# EAGLE design rpiSensors (EAGLE 6.2)
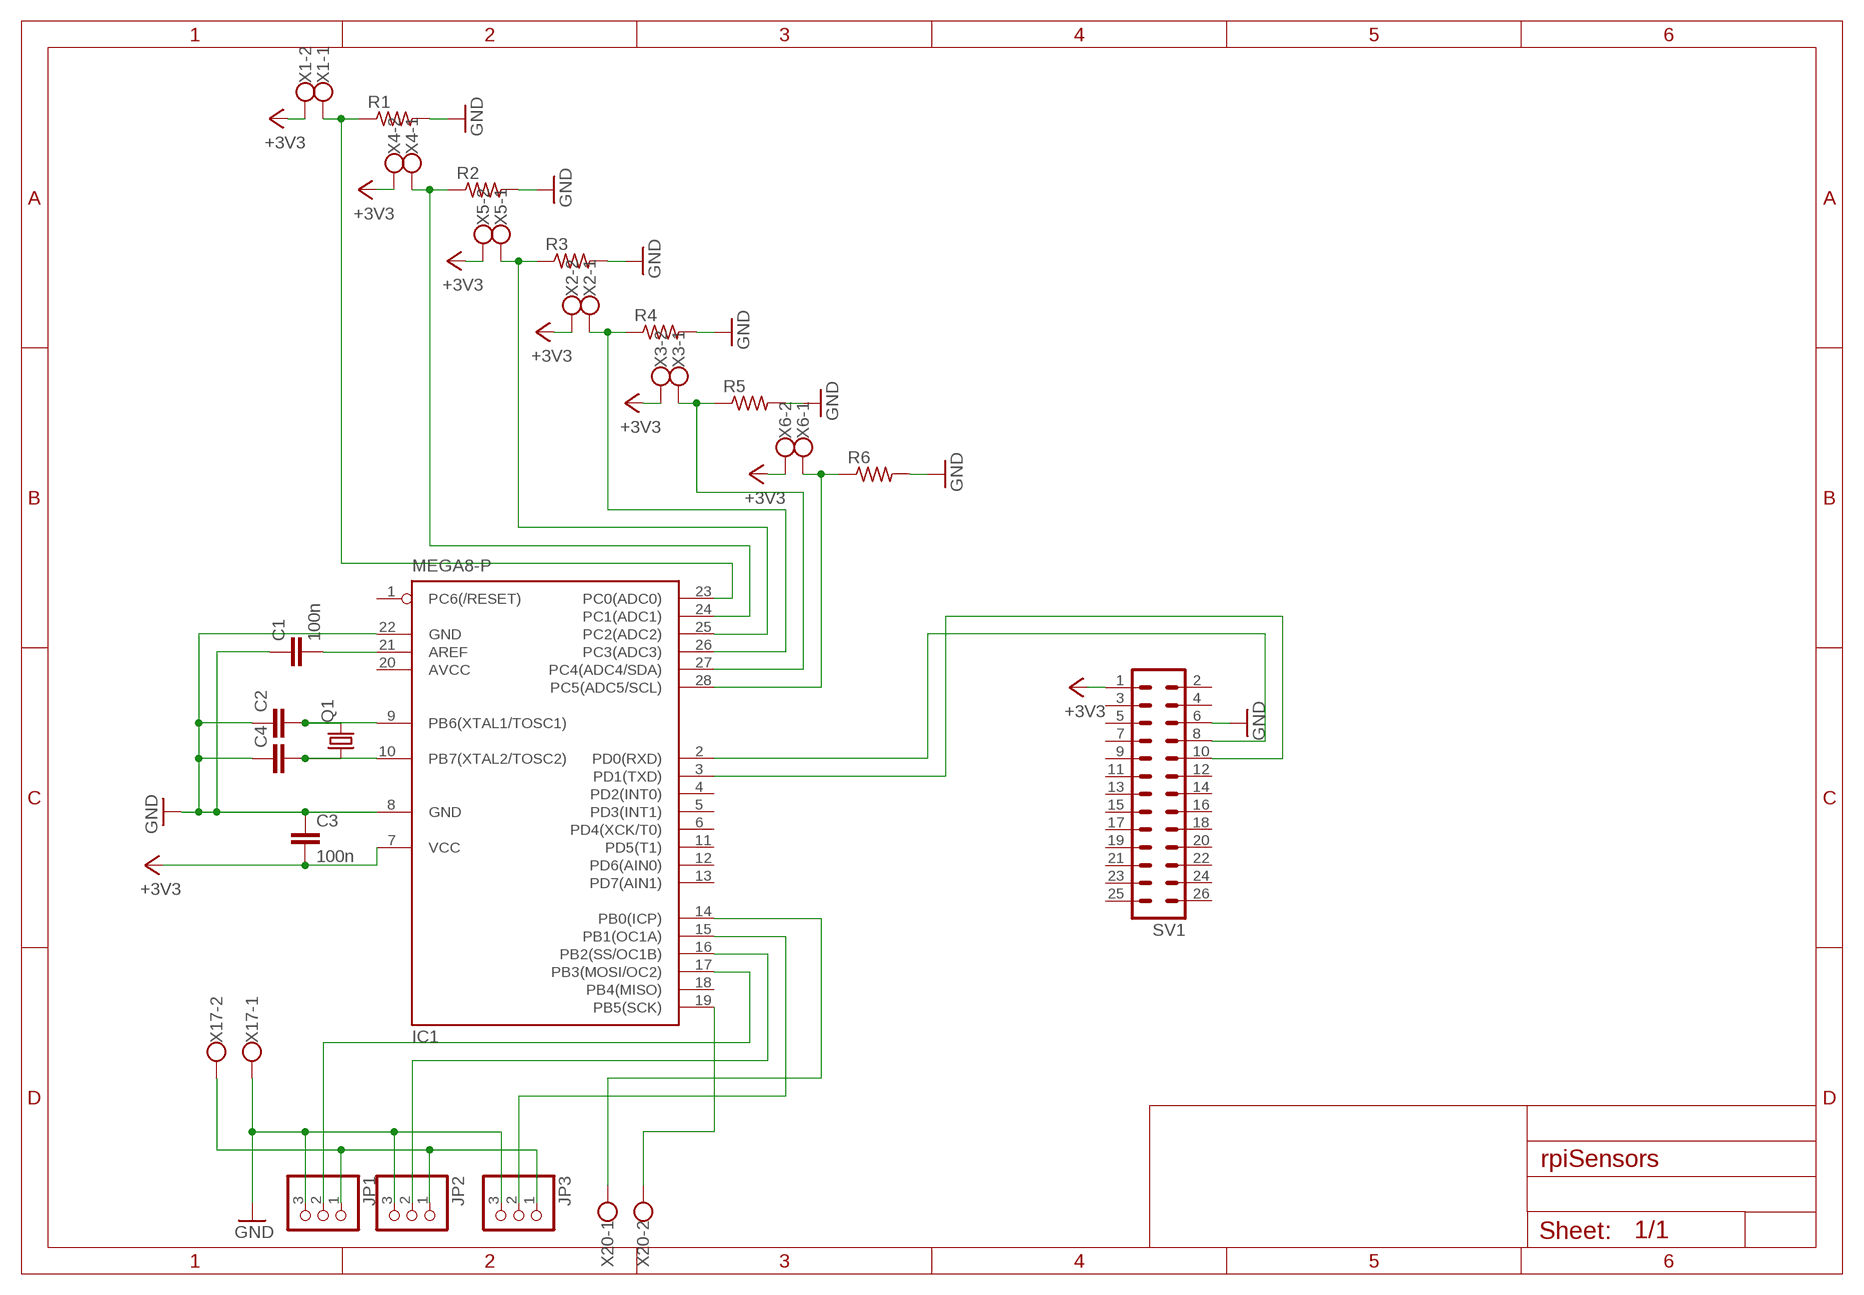
[diagram p0: schematic, sheet 1]

## Parts
C1  100n  C2,5-3  [C2.5-3]
C2  C5/2.5  [C5B2.5]
C3  100n  C2,5-3  [C2.5-3]
C4  C5/2.5  [C5B2.5]
IC1  MEGA8-P  [DIL28-3]
JP1  PINHD-1X3  [1X03]
JP2  PINHD-1X3  [1X03]
JP3  PINHD-1X3  [1X03]
Q1  CRYSTALHC49S  [HC49/S]
R1  R-US_0309/12  [0309/12]
R2  R-US_0309/12  [0309/12]
R3  R-US_0309/12  [0309/12]
R4  R-US_0309/12  [0309/12]
R5  R-US_0309/12  [0309/12]
R6  R-US_0309/12  [0309/12]
SV1  ML26  [ML26]
X1  W237-102  [W237-102]
X2  W237-102  [W237-102]
X3  W237-102  [W237-102]
X4  W237-102  [W237-102]
X5  W237-102  [W237-102]
X6  W237-102  [W237-102]
X17  W237-102  [W237-102]
X20  W237-102  [W237-102]

## Nets
+3V3: C3.2 IC1.7(VCC) SV1.1 X1.2 X2.2 X3.2 X4.2 X5.2 X6.2
GND: C1.1 C2.1 C3.1 C4.1 IC1.8(GND) IC1.22(GND) JP1.3 JP2.3 JP3.3 R1.2 R2.2 R3.2 R4.2 R5.2 R6.2 SV1.6 X17.1
N$1: IC1.2(PD0(RXD)) SV1.8
N$2: IC1.3(PD1(TXD)) SV1.10
N$3: IC1.23(PC0(ADC0)) R1.1 X1.1
N$4: IC1.24(PC1(ADC1)) R2.1 X4.1
N$5: IC1.27(PC4(ADC4/SDA)) R5.1 X3.1
N$6: IC1.25(PC2(ADC2)) R3.1 X5.1
N$7: IC1.26(PC3(ADC3)) R4.1 X2.1
N$8: IC1.28(PC5(ADC5/SCL)) R6.1 X6.1
N$23: IC1.17(PB3(MOSI/OC2)) JP1.2
N$24: IC1.16(PB2(SS/OC1B)) JP2.2
N$25: IC1.15(PB1(OC1A)) JP3.2
N$27: IC1.19(PB5(SCK)) X20.2
N$28: IC1.14(PB0(ICP)) X20.1
N$35: C1.2 IC1.21(AREF)
N$36: JP1.1 JP2.1 JP3.1 X17.2
N$37: C2.2 IC1.9(PB6(XTAL1/TOSC1)) Q1.2
N$38: C4.2 IC1.10(PB7(XTAL2/TOSC2)) Q1.1
Unconnected: IC1.1(PC6(/RESET)) IC1.4(PD2(INT0)) IC1.5(PD3(INT1)) IC1.6(PD4(XCK/T0)) IC1.11(PD5(T1)) IC1.12(PD6(AIN0)) IC1.13(PD7(AIN1)) IC1.18(PB4(MISO)) SV1.2 SV1.3 SV1.4 SV1.5 SV1.7 SV1.9 SV1.11 SV1.12 SV1.13 SV1.14 SV1.15 SV1.16 SV1.17 SV1.18 SV1.19 SV1.20 SV1.21 SV1.22 SV1.23 SV1.24 SV1.25 SV1.26

## Power pins joined to a net without a drawn wire
AVCC: IC1.20(AVCC)

## Library data of the parts
C1-C4 = capacitor-wima:C: CAPACITOR naming: grid - package width
IC1 = atmel:MEGA8-P: MICROCONTROLLER 8 Kbytes FLASH, 1 kbytes SRAM, 512 bytes EEPROM, USART, 4-channel 10 bit ADC, 2-channel 8 bit ADC Pin compatible with Atmega48, ATMega88, ATMega168 Source: avr.lbr; OC_FARNELL: unknown; OC_NEWARK: unknown
JP1-JP3 = pinhead:PINHD-1X3: PIN HEADER
Q1 = crystal:CRYSTAL: CRYSTAL; OC_FARNELL: 1667008; OC_NEWARK: unknown
R1-R6 = resistor:R-US_: RESISTOR, American symbol
SV1 = con-harting-ml:ML26: HARTING; OC_FARNELL: unknown; OC_NEWARK: unknown
X1-X6 X17 X20 = con-wago-500:W237-102: WAGO SCREW CLAMP; MPN: 237-102; OC_FARNELL: unknown; OC_NEWARK: 70K9898

## Board
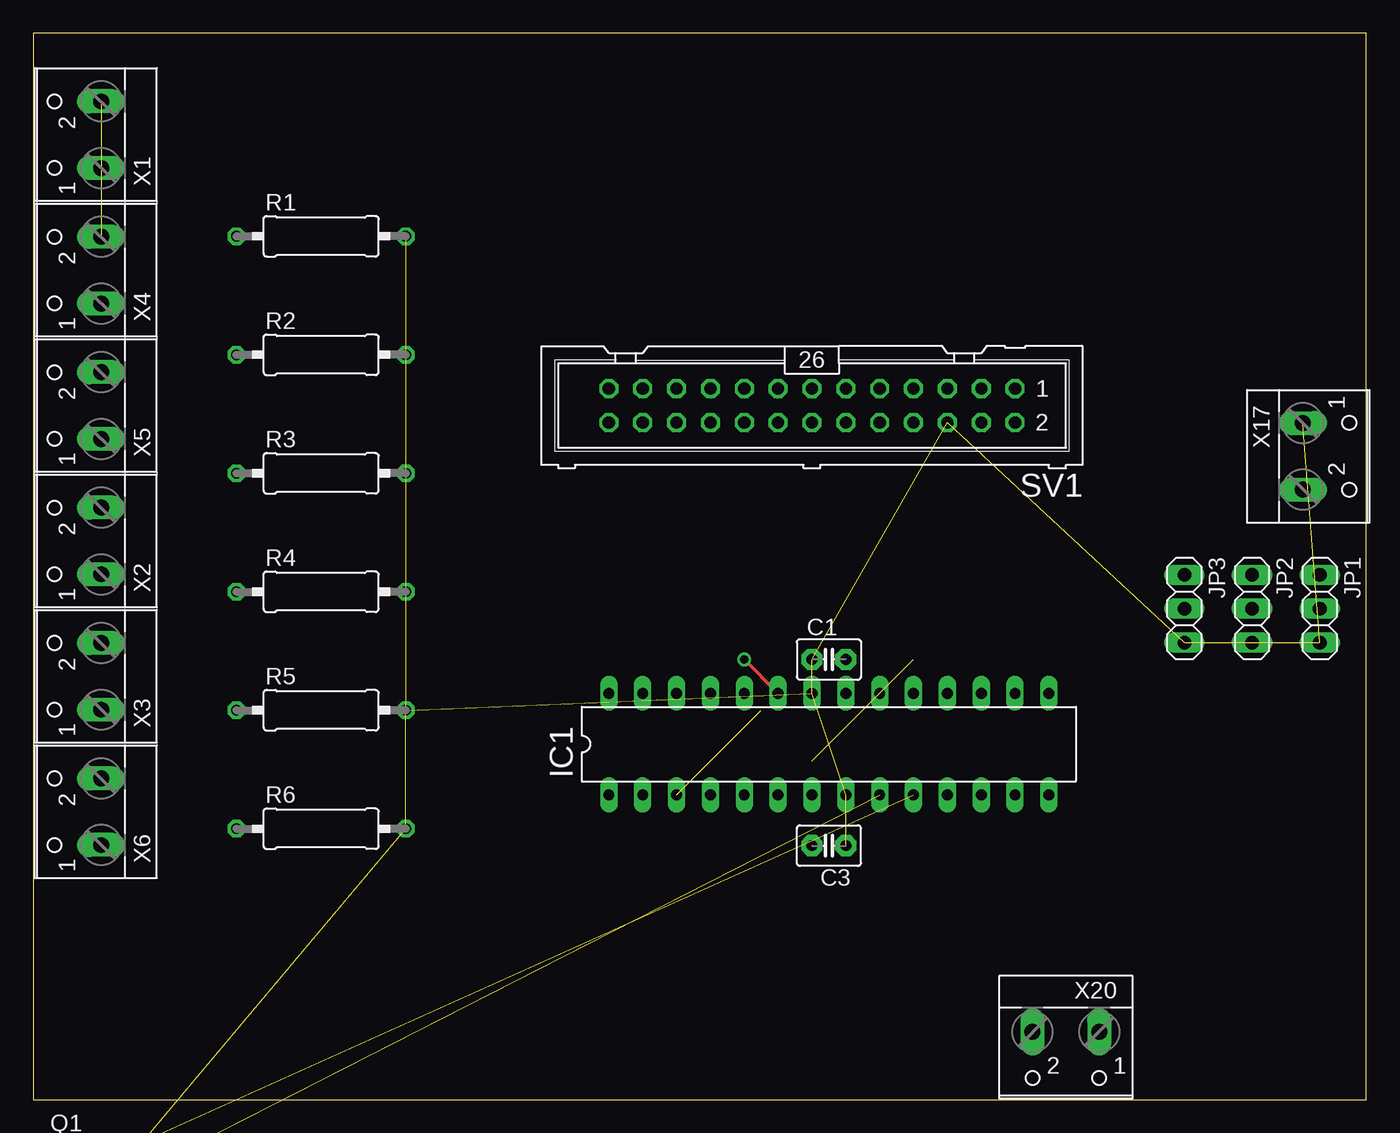
[diagram p1: board, top side]
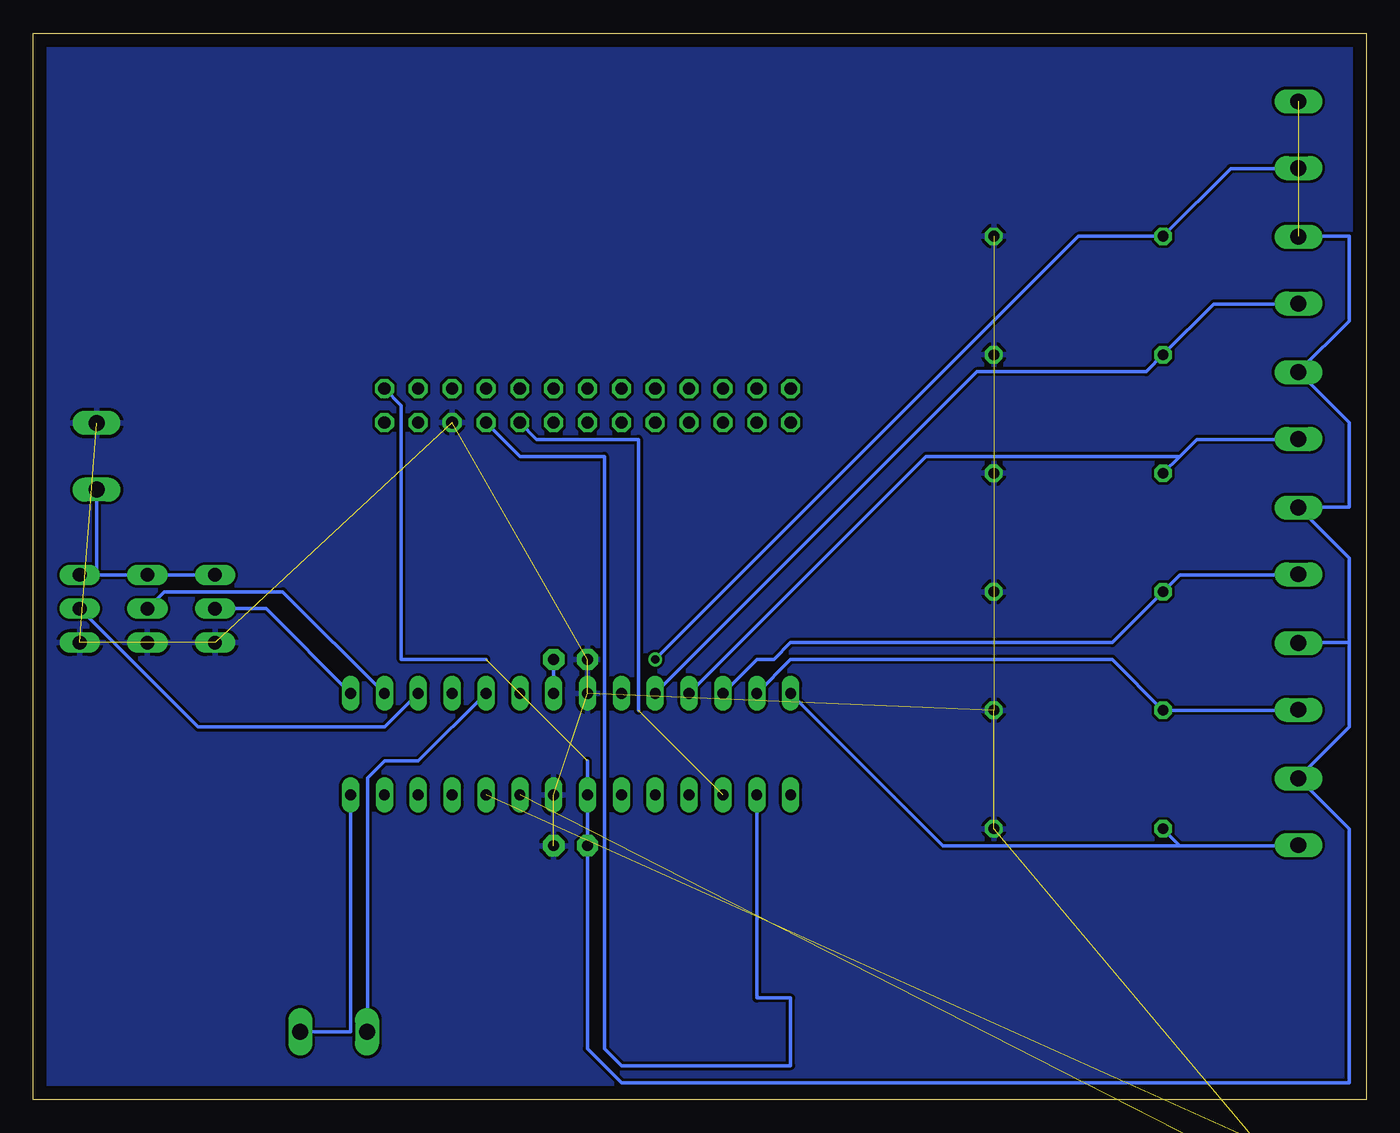
[diagram p2: board, bottom side, seen from below]

Size 100 x 80 mm. Coordinates in mm from the lower left corner, seen from the top.
Outline: 0,0 100,0 100,80 0,80 0,0
Copper layers (1*16): Top 0.035mm / dielectric 1.5mm / Bottom 0.035mm
Design rules: minimum track width 10mil, minimum drill 24mil, track to track 8mil, track to pad 8mil, pad to pad 8mil, via to via 8mil, smd to smd 8mil, copper to edge 40mil, drill to drill 8mil, minimum pad ring 10mil, minimum via ring 8mil, stop-mask expansion 4mil, vias tented up to drill 0mil, thermal gap 10mil

### Footprints (pad centres in the part's own frame; a part is rotated, then mirrored left to right if it is on the bottom)
C2.5-3 = drill 0.813 pad 1.6 octagon: 1 -1.27,0; 2 1.27,0
C5B2.5 = drill 0.813 pad 1.6 octagon: 1 -2.54,0; 2 2.54,0
DIL28-3 = drill 0.813 long: 1 -16.51,-3.81; 2 -13.97,-3.81; 3 -11.43,-3.81; 4 -8.89,-3.81; 5 -6.35,-3.81; 6 -3.81,-3.81; 7 -1.27,-3.81; 8 1.27,-3.81; 9 3.81,-3.81; 10 6.35,-3.81; 11 8.89,-3.81; 12 11.43,-3.81; 13 13.97,-3.81; 14 16.51,-3.81; 15 16.51,3.81; 16 13.97,3.81; 17 11.43,3.81; 18 8.89,3.81; 19 6.35,3.81; 20 3.81,3.81; 21 1.27,3.81; 22 -1.27,3.81; 23 -3.81,3.81; 24 -6.35,3.81; 25 -8.89,3.81; 26 -11.43,3.81; 27 -13.97,3.81; 28 -16.51,3.81
1X03 = drill 1.016 long: 1 -2.54,0; 2 0,0; 3 2.54,0
HC49/S = drill 0.813: 1 -2.413,0; 2 2.413,0
0309/12 = drill 0.813 octagon: 1 -6.35,0; 2 6.35,0
ML26 = drill 0.914 octagon: 1 -15.24,-1.27; 2 -15.24,1.27; 3 -12.7,-1.27; 4 -12.7,1.27; 5 -10.16,-1.27; 6 -10.16,1.27; 7 -7.62,-1.27; 8 -7.62,1.27; 9 -5.08,-1.27; 10 -5.08,1.27; 11 -2.54,-1.27; 12 -2.54,1.27; 13 0,-1.27; 14 0,1.27; 15 2.54,-1.27; 16 2.54,1.27; 17 5.08,-1.27; 18 5.08,1.27; 19 7.62,-1.27; 20 7.62,1.27; 21 10.16,-1.27; 22 10.16,1.27; 23 12.7,-1.27; 24 12.7,1.27; 25 15.24,-1.27; 26 15.24,1.27
W237-102 = drill 1.194 long: 1 -2.5,-1.27; 2 2.5,-1.27

### Placement (x,y rotation side)
C1  59.69,33.02 0 top
C2  3.81,-11.43 0 top  (outside the outline)
C3  59.69,19.05 180 top
C4  3.81,-16.51 0 top  (outside the outline)
IC1  59.69,26.67 0 top
JP1  96.52,36.83 270 top
JP2  91.44,36.83 270 top
JP3  86.36,36.83 270 top
Q1  6.35,-5.08 0 top  (outside the outline)
R1  21.59,64.77 0 top
R2  21.59,55.88 0 top
R3  21.59,46.99 0 top
R4  21.59,38.1 0 top
R5  21.59,29.21 0 top
R6  21.59,20.32 0 top
SV1  58.42,52.07 180 top
X1  3.81,72.39 90 top
X2  3.81,41.91 90 top
X3  3.81,31.75 90 top
X4  3.81,62.23 90 top
X5  3.81,52.07 90 top
X6  3.81,21.59 90 top
X17  96.52,48.26 270 top
X20  77.47,3.81 180 top

### Tracks (layer width: path | path; a pad name or v marks a point on that pad's centre or on a via)
+3V3  (2 unrouted)
  Bottom 0.254: 5.08,54.61 1.27,58.42 1.27,64.77 5.08,64.77 X4.2 | 5.08,24.13 1.27,27.94 1.27,34.29 | 1.27,34.29 5.08,34.29 X3.2 | 5.08,44.45 1.27,40.64 1.27,34.29 | 5.08,54.61 1.27,50.8 1.27,44.45 5.08,44.45 | 5.08,54.61 X5.2 | 5.08,44.45 X2.2 | 58.42,25.4 IC1.7 C3.2 58.42,3.81 55.88,1.27 1.27,1.27 1.27,20.32 5.08,24.13 | SV1.1 72.39,52.07 72.39,33.02 66.04,33.02 | 5.08,24.13 X6.2
GND  (16 unrouted)
  pour Bottom: 0,80.01 100.33,80.01 100.33,0 0,0
N$1
  Bottom 0.254: IC1.2 45.72,7.62 43.18,7.62 43.18,2.54 55.88,2.54 57.15,3.81 57.15,48.26 63.5,48.26 SV1.8
N$2  (1 unrouted)
  Bottom 0.254: 54.61,29.21 54.61,49.53 62.23,49.53 SV1.10
N$3  (via drill 0.61)
  Top 0.254: v53.34,33.02 IC1.23
  Bottom 0.254: X1.1 5.08,69.85 10.16,69.85 R1.1 21.59,64.77 v53.34,33.02
N$4
  Bottom 0.254: X4.1 5.08,59.69 11.43,59.69 R2.1 16.51,54.61 29.21,54.61 IC1.24
N$5
  Bottom 0.254: X3.1 5.08,29.21 R5.1 19.05,33.02 43.18,33.02 IC1.27
N$6
  Bottom 0.254: 13.97,48.26 12.7,49.53 5.08,49.53 X5.1 | 13.97,48.26 R3.1 | IC1.25 33.02,48.26 13.97,48.26
N$7
  Bottom 0.254: X2.1 5.08,39.37 13.97,39.37 R4.1 19.05,34.29 43.18,34.29 44.45,33.02 45.72,33.02 IC1.26
N$8
  Bottom 0.254: 13.97,19.05 R6.1 | 13.97,19.05 5.08,19.05 X6.1 | IC1.28 31.75,19.05 13.97,19.05
N$23
  Bottom 0.254: IC1.17 73.66,27.94 87.63,27.94 JP1.2
N$24
  Bottom 0.254: IC1.16 81.28,38.1 90.17,38.1 JP2.2
N$25
  Bottom 0.254: IC1.15 82.55,36.83 JP3.2
N$27
  Bottom 0.254: IC1.19 71.12,25.4 73.66,25.4 74.93,24.13 74.93,5.08 X20.2
N$28
  Bottom 0.254: IC1.14 76.2,5.08 X20.1 80.01,5.08
N$35
  Bottom 0.254: C1.2 IC1.21
N$36
  Bottom 0.254: JP3.1 JP2.1 95.25,39.37 | 95.25,39.37 X17.2 | 95.25,39.37 JP1.1
N$37  (2 unrouted)
N$38  (2 unrouted)